# Altium schematic sheet ADC_Filter.SchDoc: =ProjectName
size 420 x 297 mm; Author: SBH; CompanyName: WUT; DrawnBy: SBH; Organization: ISE-WUT; Address1: Warsaw Univeristy of Technology; Address2: Nowowiejska 15/19; Revision: -; SheetNumber: -; SheetTotal: -; EDA_Number: ARTIQ; Projet: ADC/DAC MEZZANINE; ModifiedBy: -; CreateDate: XX/XX/XXXX; CheckedDate: -; Title2: ADC_Filter.SchDoc; DivGrp: ISE; Designer: SBH; ModifiedDate: -; ProjectName: ADC/DAC MEZZANINE
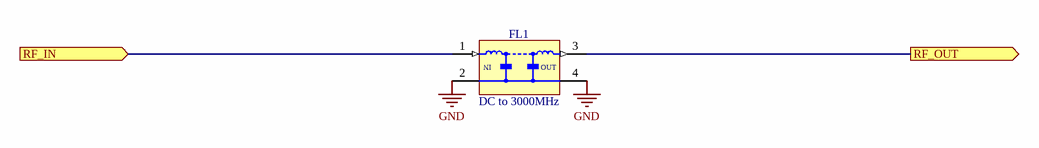
[diagram p0: ADC_Filter.SchDoc]

## Parts
FL1  DC to 3000MHz  [FIL_MINI-CIRCUITS_FV1206]

## Ports
RF_IN (in), RF_OUT (out)

## Nets
GND: FL1.2(GND) FL1.4(GND)
RF_IN: FL1.1(RFIN) ; port RF_IN
RF_OUT: FL1.3(RFOUT) ; port RF_OUT

## Notes on the sheet
- Project/Equipment
- Document
- Designer
- Drawn by
- Check.by
- File
- Last Mod.
- Print Date
- Sheet
- Size
- A3
- of
- Rev
- (in symbol FIL_MINI-CIRCUITS_LFCN-3000+) IN; OUT

## Library data of the parts
FL1 = FIL_MINI-CIRCUITS_LFCN-3000+: 50 Ohm DC to 3000MHz Low Pass Filter; Part Description: 50 Ohm Low Pass Filter; Part Number: FIL_MINI-CIRCUITS_LFCN-3000+; Component Kind: Standard; Component Type: Standard; Pin Count: 2; Value: DC to 3000MHz; Status: None; Manufacturer: MINI-CIRCUITS; Manufacturer Part Number: LFCN-3000+; Mounted: Yes; Socket: No; SMD: Yes; Sense: No; ComponentHeight: 0.94mm; HelpURL: \\cern.ch\dfs\Applications\Altium\Datasheets\FIL_MINI-CIRCUITS_LFCN-3000+.pdf; Author: CERN DEM JLC; CreateDate: 2013-12-09; LatestRevisionDate: 2013-12-09